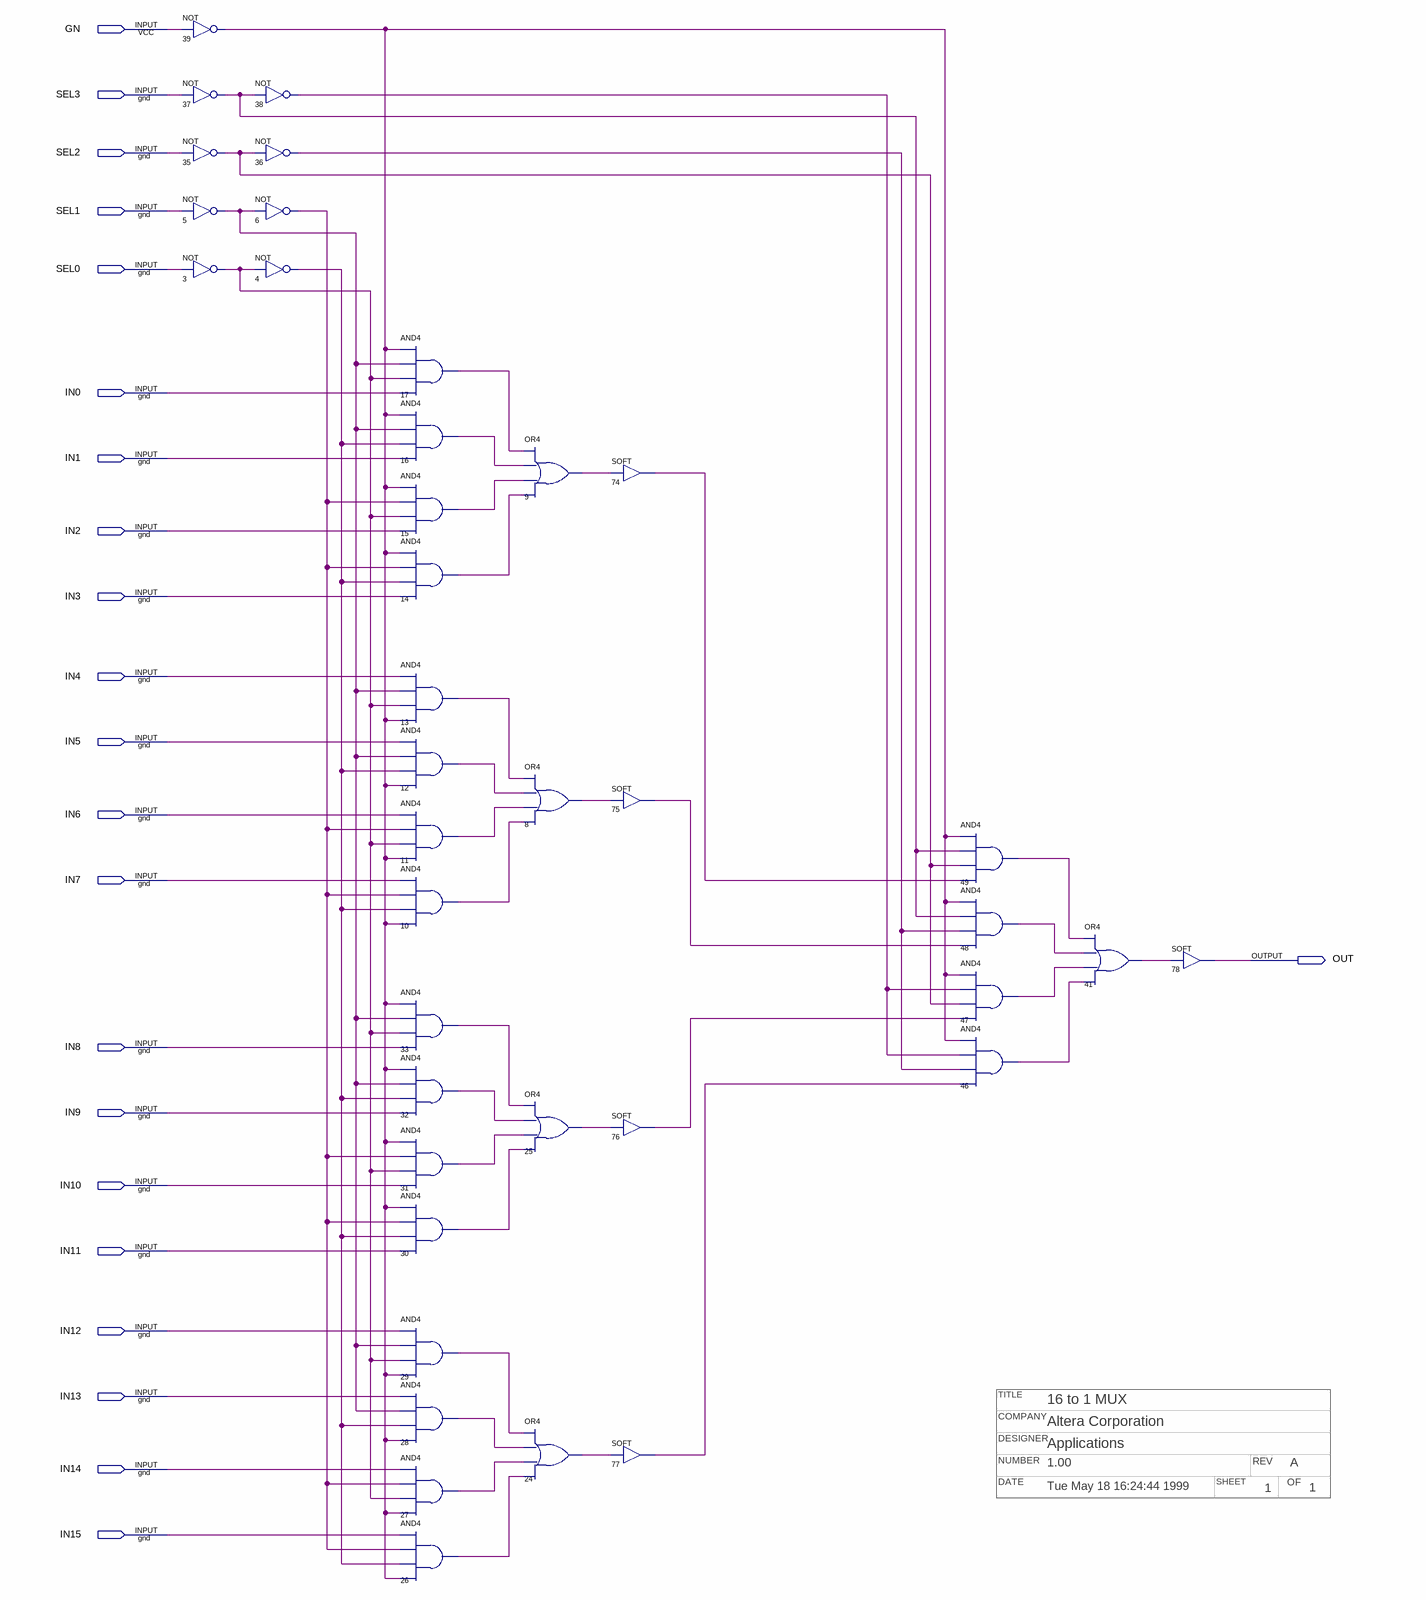
[diagram p0: schematic sheet]
// Quartus schematic 161mux.bdf as structural Verilog: 39 symbols, 22 pins
// Title block: TITLE: 16 to 1 MUX; COMPANY: Altera Corporation; DESIGNER: Applications; NUMBER: 1.00; REV: A; DATE: Tue May 18 16:24:44 1999; SHEET: 1; OF: 1
module \161mux  (
  input  GN,
  input  SEL3,
  input  SEL2,
  input  SEL1,
  input  SEL0,
  input  IN0,
  input  IN1,
  input  IN2,
  input  IN3,
  input  IN4,
  input  IN5,
  input  IN6,
  input  IN7,
  input  IN8,
  input  IN9,
  input  IN10,
  input  IN11,
  input  IN12,
  input  IN13,
  input  IN14,
  input  IN15,
  output OUT
);

  wire n3_out, n4_out, n5_out, n6_out, n8_out, n9_out, n10_out, n11_out, n12_out, n13_out, n14_out, n15_out,
       n16_out, n17_out, n24_out, n25_out, n26_out, n27_out, n28_out, n29_out, n30_out, n31_out, n32_out,
       n33_out, n35_out, n36_out, n37_out, n38_out, n39_out, n41_out, n46_out, n47_out, n48_out, n49_out,
       n74_out, n75_out, n76_out, n77_out;

  not u_39 (n39_out, GN);
  not u_37 (n37_out, SEL3);
  not u_35 (n35_out, SEL2);
  not u_5 (n5_out, SEL1);
  not u_3 (n3_out, SEL0);
  not u_38 (n38_out, n37_out);
  not u_36 (n36_out, n35_out);
  not u_6 (n6_out, n5_out);
  not u_4 (n4_out, n3_out);
  and u_17 (n17_out, n39_out, n5_out, n3_out, IN0);
  and u_16 (n16_out, n39_out, n5_out, n4_out, IN1);
  and u_15 (n15_out, n39_out, n6_out, n3_out, IN2);
  and u_14 (n14_out, n39_out, n6_out, n4_out, IN3);
  and u_13 (n13_out, IN4, n5_out, n3_out, n39_out);
  and u_12 (n12_out, IN5, n5_out, n4_out, n39_out);
  and u_11 (n11_out, IN6, n6_out, n3_out, n39_out);
  and u_10 (n10_out, IN7, n6_out, n4_out, n39_out);
  and u_33 (n33_out, n39_out, n5_out, n3_out, IN8);
  and u_32 (n32_out, n39_out, n5_out, n4_out, IN9);
  and u_31 (n31_out, n39_out, n6_out, n3_out, IN10);
  and u_30 (n30_out, n39_out, n6_out, n4_out, IN11);
  and u_29 (n29_out, IN12, n5_out, n3_out, n39_out);
  and u_28 (n28_out, IN13, n5_out, n4_out, n39_out);
  and u_27 (n27_out, IN14, n6_out, n3_out, n39_out);
  and u_26 (n26_out, IN15, n6_out, n4_out, n39_out);
  or u_9 (n9_out, n17_out, n16_out, n15_out, n14_out);
  or u_8 (n8_out, n13_out, n12_out, n11_out, n10_out);
  or u_25 (n25_out, n33_out, n32_out, n31_out, n30_out);
  or u_24 (n24_out, n29_out, n28_out, n27_out, n26_out);
  SOFT u_74 (.IN(n9_out), .OUT(n74_out));
  SOFT u_75 (.IN(n8_out), .OUT(n75_out));
  SOFT u_76 (.IN(n25_out), .OUT(n76_out));
  SOFT u_77 (.IN(n24_out), .OUT(n77_out));
  and u_49 (n49_out, n39_out, n37_out, n35_out, n74_out);
  and u_48 (n48_out, n39_out, n37_out, n36_out, n75_out);
  and u_47 (n47_out, n39_out, n38_out, n35_out, n76_out);
  and u_46 (n46_out, n39_out, n38_out, n36_out, n77_out);
  or u_41 (n41_out, n49_out, n48_out, n47_out, n46_out);
  SOFT u_78 (.IN(n41_out), .OUT(OUT));
endmodule
